# EAGLE design BT_interface (EAGLE 6.1)
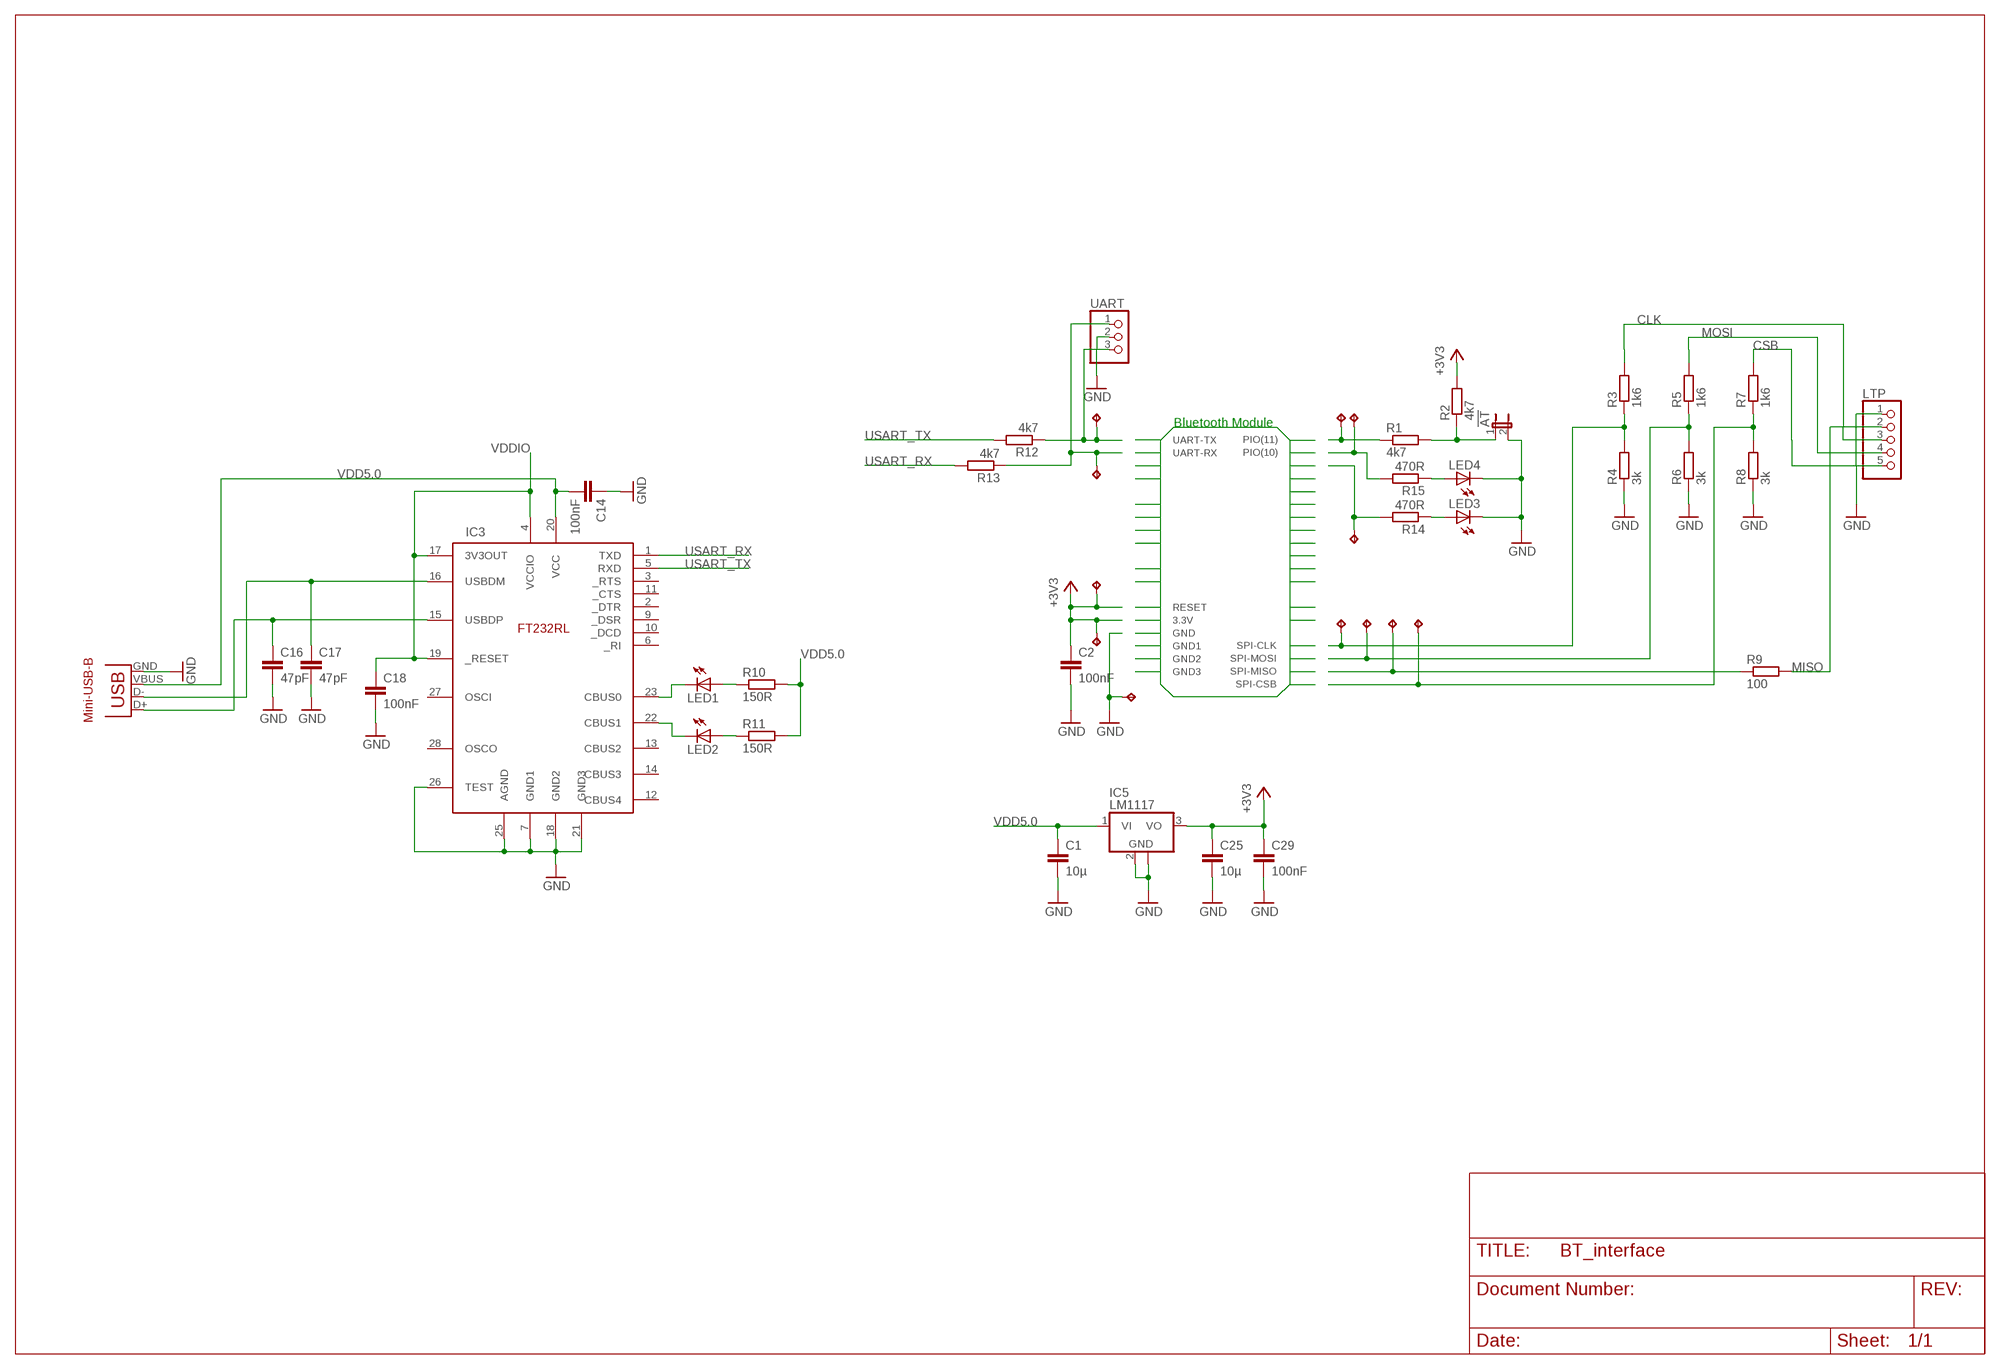
[diagram p0: schematic, sheet 1]

## Parts
!AT  JUMPER-2PTH  [1X02]
C1  10µ  C-EUC0805  [C0805]
C2  100nF  C-EUC0805  [C0805]
C14  100nF  C-EUC0805  [C0805]
C16  47pF  C-EUC0805  [C0805]
C17  47pF  C-EUC0805  [C0805]
C18  100nF  C-EUC0805  [C0805]
C25  10µ  C-EUC0805  [C0805]
C29  100nF  C-EUC0805  [C0805]
IC3  FT232RL  [SSOP28DB]
IC5  UA78M05DCY  [SOT223]
LED1  LEDCHIPLED_0603  [CHIPLED_0603]
LED2  LEDCHIPLED_0603  [CHIPLED_0603]
LED3  LEDCHIPLED_0603  [CHIPLED_0603]
LED4  LEDCHIPLED_0603  [CHIPLED_0603]
LTP  PINHD-1X5  [1X05]
R1  4k7  R-EU_R0805  [R0805]
R2  4k7  R-EU_R0805  [R0805]
R3  1k6  R-EU_R0805  [R0805]
R4  3k  R-EU_R0805  [R0805]
R5  1k6  R-EU_R0805  [R0805]
R6  3k  R-EU_R0805  [R0805]
R7  1k6  R-EU_R0805  [R0805]
R8  3k  R-EU_R0805  [R0805]
R9  100  R-EU_R0805  [R0805]
R10  150R  R-EU_R0805  [R0805]
R11  150R  R-EU_R0805  [R0805]
R12  4k7  R-EU_R0805  [R0805]
R13  4k7  R-EU_R0805  [R0805]
R14  470R  R-EU_R0805  [R0805]
R15  470R  R-EU_R0805  [R0805]
U$2  SPRING_HEADER  [SPRING_HEADER]
U$3  SPRING_HEADER  [SPRING_HEADER]
U$4  SPRING_HEADER  [SPRING_HEADER]
U$5  SPRING_HEADER  [SPRING_HEADER]
U$6  SPRING_HEADER  [SPRING_HEADER]
U$7  SPRING_HEADER  [SPRING_HEADER]
U$8  SPRING_HEADER  [SPRING_HEADER]
U$9  SPRING_HEADER  [SPRING_HEADER]
U$10  SPRING_HEADER  [SPRING_HEADER]
U$11  SPRING_HEADER  [SPRING_HEADER]
U$12  SPRING_HEADER  [SPRING_HEADER]
U$13  SPRING_HEADER  [SPRING_HEADER]
UART  PINHD-1X3  [1X03]
USB1  USB-MB-S2  [USB-MP-S2]

## Nets
+3V3: C2.1 C25.1 C29.1 IC5.3(VO) R2.2 U$4.P$1(TP) U$5.P$1(TP)
CLK: LTP.3 R3.2
CSB: LTP.5 R7.2
D+: C16.1 IC3.15(USBDP) USB1.D+
D-: C17.1 IC3.16(USBDM) USB1.D-
GND: !AT.2 C1.2 C2.2 C14.1 C16.2 C17.2 C18.2 C25.2 C29.2 IC3.7(GND1) IC3.18(GND2) IC3.21(GND3) IC3.25(AGND) IC3.26(TEST) IC5.2(GND) IC5.4(GND) LED3.C LED4.C LTP.1 R4.1 R6.1 R8.1 U$6.P$1(TP) UART.2 USB1.GND
MISO: LTP.2 R9.2
MOSI: LTP.4 R5.2
N$1: R1.1 U$9.P$1(TP)
N$2: IC3.23(CBUS0) LED1.C
N$3: IC3.22(CBUS1) LED2.C
N$4: LED1.A R10.1
N$5: LED2.A R11.1
N$6: !AT.1 R1.2 R2.1
N$7: R7.1 R8.2 U$11.P$1(TP)
N$8: R5.1 R6.2 U$7.P$1(TP)
N$9: R3.1 R4.2 U$8.P$1(TP)
N$10: R12.1 U$2.P$1(TP) UART.3
N$11: R13.1 U$3.P$1(TP) UART.1
N$12: LED3.A R14.1
N$13: LED4.A R15.1
N$14: R14.2 U$13.P$1(TP)
N$15: R9.1 U$10.P$1(TP)
N$16: R15.2 U$12.P$1(TP)
USART_RX: IC3.1(TXD) R13.2
USART_TX: IC3.5(RXD) R12.2
VDD5.0: C1.1 C14.2 IC3.20(VCC) IC5.1(VI) R10.2 R11.2 USB1.VBUS
VDDIO: C18.1 IC3.4(VCCIO) IC3.17(3V3OUT) IC3.19(_RESET)
Unconnected: IC3.2(_DTR) IC3.3(_RTS) IC3.6(_RI) IC3.9(_DSR) IC3.10(_DCD) IC3.11(_CTS) IC3.12(CBUS4) IC3.13(CBUS2) IC3.14(CBUS3) IC3.27(OSCI) IC3.28(OSCO)

## Notes on the sheet
- Bluetooth Module
- PIO(11)
- UART-TX
- PIO(10)
- UART-RX
- RESET
- 3.3V
- FT232RL
- GND
- SPI-CLK
- GND1
- SPI-MOSI
- GND2
- SPI-MISO
- GND3
- SPI-CSB
- Mini-USB-B

## Library data of the parts
!AT = daGloane:JUMPER-2: Jumper Basic 0.1" spaced jumper. Use with breakaway headers.
C1 C2 C14 C16-C18 C25 C29 = rcl:C-EU: CAPACITOR, European symbol
IC3 = ftdichip:FT232RL: USB UART 4th Generation USB UART (USB <-> Serial) Controller
IC5 = linear:UA78M*: POSITIVE-VOLTAGE REGULATORS Source: http://focus.ti.com/lit/ds/symlink/ua78m33.pdf; LM1117: LM1117
LED1-LED4 = led:LED: LED OSRAM: - CHIPLED LG R971, LG N971, LY N971, LG Q971, LY Q971, LO R971, LY R971 LH N974, LH R974 LS Q976, LO Q976, LY Q976 LO Q996 - Hyper CHIPLED LW Q18S LB Q993, LB Q99A, LB R99A - SideLED LS A670, LO A670, LY A670, LG A670, LP A670 LB A673, LV A673, LT A673, LW A673 LH A674 LY A675 LS A676, LA A676, LO A676, LY A676, LW A676 LS A679, LY A679, LG A679 - Hyper Micro SIDELED® LS Y876, LA Y876, LO Y876, LY Y876 LT Y87S - SmartLED LW L88C, LW L88S LB L89C, LB L89S, LG L890 LS L89K, LO L89K, LY L89K LS L896, LA L896, LO L896, LY L896 - TOPLED LS T670, LO T670, LY T670, LG T670, LP T670 LSG T670, LSP T670, LSY T670, LOP T670, LYG T670 LG T671, LOG T671, LSG T671 LB T673, LV T673, LT T673, LW T673 LH T674 LS T676, LA T676, LO T676, LY T676, LB T676, LH T676, LSB T676, LW T676 LB T67C, LV T67C, LT T67C, LS T67K, LO T67K, LY T67K, LW E67C LS E67B, LA E67B, LO E67B, LY E67B, LB E67C, LV E67C, LT E67C LW T67C LS T679, LY T679, LG T679 LS T770, LO T770, LY T770, LG T770, LP T770 LB T773, LV T773, LT T773, LW T773 LH T774 LS E675, LA E675, LY E675, LS T675 LS T776, LA T776, LO T776, LY T776, LB T776 LHGB T686 LT T68C, LB T68C - Hyper Mini TOPLED® LB M676 - Mini TOPLED Santana® LG M470 LS M47K, LO M47K, LY M47K Source: http://www.osram.convergy.de LUXEON: - LUMILED® LXK2-PW12-R00, LXK2-PW12-S00, LXK2-PW14-U00, LXK2-PW14-V00 LXK2-PM12-R00, LXK2-PM12-S00, LXK2-PM14-U00 LXK2-PE12-Q00, LXK2-PE12-R00, LXK2-PE12-S00, LXK2-PE14-T00, LXK2-PE14-U00 LXK2-PB12-K00, LXK2-PB12-L00, LXK2-PB12-M00, LXK2-PB14-N00, LXK2-PB14-P00, LXK2-PB14-Q00 LXK2-PR12-L00, LXK2-PR12-M00, LXK2-PR14-Q00, LXK2-PR14-R00 LXK2-PD12-Q00, LXK2-PD12-R00, LXK2-PD12-S00 LXK2-PH12-R00, LXK2-PH12-S00 LXK2-PL12-P00, LXK2-PL12-Q00, LXK2-PL12-R00 Source: www.luxeon.com KINGBRIGHT: KA-3528ASYC Source: www.kingbright.com
LTP = pinhead:PINHD-1X5: PIN HEADER
R1-R15 = rcl:R-EU_: RESISTOR, European symbol
U$2-U$13 = daGloane:SPRING_HEADER
UART = pinhead:PINHD-1X3: PIN HEADER
USB1 = con-usb:USB: USB Connectors

## Board
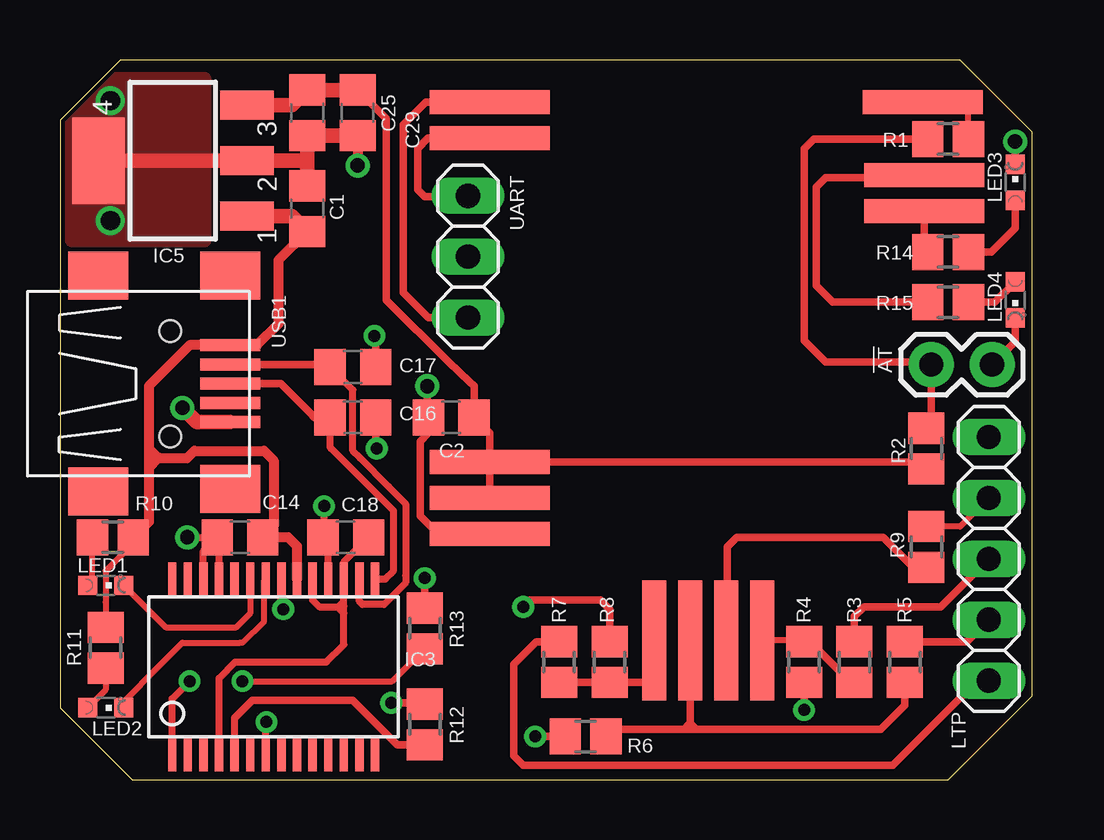
[diagram p1: board, top side]
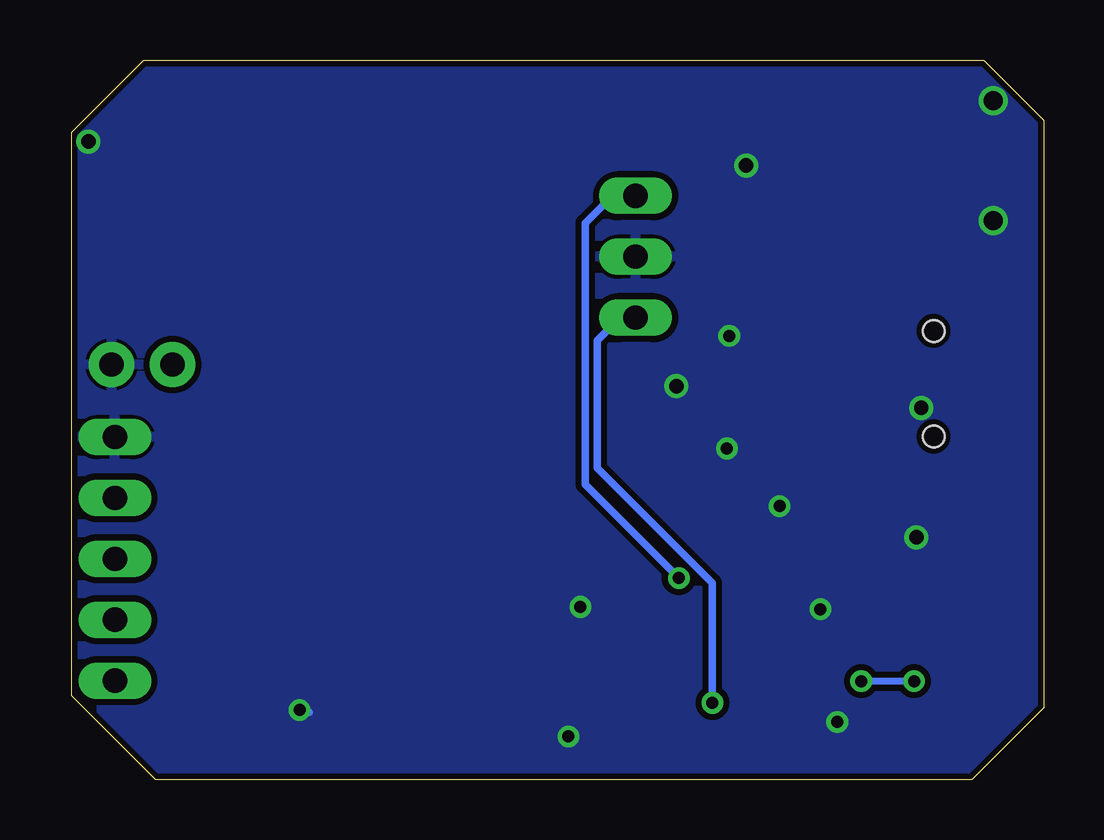
[diagram p2: board, bottom side, seen from below]

Size 40.5 x 30 mm. Coordinates in mm from the lower left corner, seen from the top.
Outline: 3,0 37,0 40.5,3.5 40.5,27 37.5,30 2.5,30 0,27.5 0,3 3,0
Copper layers (1*16): Top 0.035mm / dielectric 1.5mm / Bottom 0.035mm
Design rules: minimum track width 0.15mm, minimum drill 0.3mm, track to track 0.15mm, track to pad 0.15mm, pad to pad 0.15mm, via to via 0.15mm, smd to smd 0mil, copper to edge 0.2mm, drill to drill 0.2mm, minimum pad ring 0.2mm, minimum via ring 0.2mm, stop-mask expansion 4mil, vias tented up to drill 0.8mm, thermal gap 0.15mm

### Footprints (pad centres in the part's own frame; a part is rotated, then mirrored left to right if it is on the bottom)
1X02 = drill 1.016 pad 1.88: 1 0,0; 2 2.54,0
C0805 = smd 1.3 x 1.5: 1 -0.95,0; 2 0.95,0
SSOP28DB = smd 0.348 x 1.397: 1 -4.225,-3.656; 2 -3.575,-3.656; 3 -2.925,-3.656; 4 -2.275,-3.656; 5 -1.625,-3.656; 6 -0.975,-3.656; 7 -0.325,-3.656; 8 0.325,-3.656; 9 0.975,-3.656; 10 1.625,-3.656; 11 2.275,-3.656; 12 2.925,-3.656; 13 3.575,-3.656; 14 4.225,-3.656; 15 4.225,3.656; 16 3.575,3.656; 17 2.925,3.656; 18 2.275,3.656; 19 1.625,3.656; 20 0.975,3.656; 21 0.325,3.656; 22 -0.325,3.656; 23 -0.975,3.656; 24 -1.625,3.656; 25 -2.275,3.656; 26 -2.925,3.656; 27 -3.575,3.656; 28 -4.225,3.656
SOT223 = smd 1.219 x 2.235: 1 -2.311,-3.099; 2 0,-3.099; 3 2.311,-3.099 | smd 3.6 x 2.2: 4 0,3.099
CHIPLED_0603 = smd 0.8 x 0.8: A 0,-0.75; C 0,0.75
1X05 = drill 1.016 long: 1 -5.08,0; 2 -2.54,0; 3 0,0; 4 2.54,0; 5 5.08,0
R0805 = smd 1.3 x 1.5: 1 -0.85,0; 2 0.85,0
SPRING_HEADER = smd 5 x 1: P$1 0,0
1X03 = drill 1.016 long: 1 -2.54,0; 2 0,0; 3 2.54,0
USB-MP-S2 = smd 2.5 x 0.5: D+ 2.487,0.005; D- 2.487,0.805; GND 2.487,-1.595; ID 2.487,-0.795; VBUS 2.487,1.605 | smd 2.5 x 2: P$1 -3.013,-4.495; P$2 -3.013,4.505; P$3 2.487,-4.395; P$4 2.487,4.505 | hole 0.9: -0.013,2.205; -0.013,-2.195

### Placement (x,y rotation side)
!AT  36.3,17.3 0 top
C1  10.3,23.8 90 top
C2  16.3,15.1 180 top
C14  7.5,10.1 0 top
C16  12.2,15.1 0 top
C17  12.2,17.2 0 top
C18  11.91,10.1 180 top
C25  10.3,27.8 270 top
C29  12.4,27.8 270 top
IC3  8.9,4.7 0 top
IC5  4.7,25.8 90 top
LED1  1.9,8.1 270 top
LED2  1.9,3 270 top
LED3  39.8,24.9 0 top
LED4  39.8,20 180 top
LTP  38.7,9.2 270 top
R1  37,26.7 180 top
R2  36.1,13.8 270 top
R3  33.1,4.9 90 top
R4  31,4.9 90 top
R5  35.2,4.9 90 top
R6  21.9,1.8 0 top
R7  20.8,4.9 90 top
R8  22.9,4.9 270 top
R9  36.1,9.7 90 top
R10  2.2,10.1 0 top
R11  1.9,5.5 90 top
R12  15.2,2.3 270 top
R13  15.2,6.3 270 top
R14  37,22 180 top
R15  37,19.9 180 top
U$2  17.9,28.23 0 top
U$3  17.9,26.73 0 top
U$4  17.9,13.23 0 top
U$5  17.9,11.73 0 top
U$6  17.9,10.23 0 top
U$7  26.25,5.8 90 top
U$8  29.25,5.8 90 top
U$9  35.95,28.23 0 top
U$10  27.75,5.8 90 top
U$11  24.75,5.8 90 top
U$12  36,25.2 0 top
U$13  36,23.7 0 top
UART  17,21.8 270 top
USB1  4.6,16.5 0 top

### Tracks (layer width: path | path; a pad name or v marks a point on that pad's centre or on a via)
+3V3
  Top 0.254: 24.13,13.23 24.6,13.23 | 33.4,13.23 34.17,13.23 | U$4.P$1 18.75,13.23
  Top 0.305: C29.1 13.6,27.55 13.6,20 16.2,17.4 17.05,16.6 17.25,16.4 C2.1 17.9,14.45 U$4.P$1 U$5.P$1 18.75,11.73 | R2.2 35.82,13.23 35.02,13.23 33.4,13.23 24.6,13.23 18.75,13.23
  Top 0.61: IC5.3 9.66,28.11 C25.1 C29.1
CLK
  Top 0.305: R3.2 33.1,6.8 33.5,7.2 36.1,7.2 36.7,7.2 LTP.3
CSB
  Top 0.305: LTP.5 38.2,4.09 35.51,1.4 34.7,0.6 19.3,0.6 18.9,1 18.9,1.9 18.9,4.8 19.7,5.6 19.85,5.75 R7.2
D+
  Top 0.3: C16.1 11.25,13.85 11.3,13.8 13.12,11.97 13.9,11.2 13.9,8.7 13.56,8.36 IC3.15
  Top 0.305: USB1.D+ 9.2,16.5 10.4,15.3 10.6,15.1 C16.1 | 11.53,15.1 C16.1 | 11.5,14.9 11.45,14.9 C16.1
  Top 0.406: 11.5,14.9 11.53,14.88
D-
  Top 0.3: C17.1 12.2,16.25 12.2,13.7 12.5,13.4 13.7,12.2 14.4,11.5 14.4,8.5 14.4,8.2 13.5,7.3 12.6,7.3 12.5,7.4 12.47,7.42 IC3.16
  Top 0.305: USB1.D- 11.15,17.3 C17.1
GND  (via drill 0.5, 0.6, 0.8)
  Top 0.254: 15.7,10.3 17.83,10.3 U$6.P$1
  Top 0.3: IC3.25 6.62,10.03 C14.1 | IC3.26 5.97,9.53 C14.1 | v5.3,10.1 C14.1 | IC3.7 8.57,2.38 v8.6,2.4 | IC3.18 11.18,9.88 C18.2 11,10.14 v11,11.4 | v9.3,7.1 9.22,7.17 IC3.21
  Top 0.305: C17.2 13.15,18.45 v13.1,18.5 | C16.2 13.15,13.85 v13.2,13.8 | C2.2 15.8,14.9 | R4.1 v31,2.9 | R8.1 22.9,7.1 22.5,7.5 19.6,7.5 v19.3,7.2 | 15.7,10.3 15,11 15,14.1 15.35,14.45 C2.2 | C2.2 15.3,15.15 v15.3,16.4 | v19.8,1.8 R6.1 | R6.1 21.1,1.8 R6.1 | LED4.C 39.8,18.26 !AT.2 | LED3.C v39.8,26.6
  Top 0.406: C29.2 v12.4,25.6
  Top 0.61: 10.3,25.8 IC5.2 IC5.4 | 10.3,25.8 C25.2 C29.2 | C1.2 10.3,25.8 | v5.1,15.5 5.7,14.9 USB1.GND
  Bottom 0.305: v13.1,18.5 12.8,18.4 | 30.9,2.8 30.6,2.8
  other vias: 2.1,28.3 2.1,23.3
  pour Top (no thermals): 0.5,29.2 6,29.2 6,22.5 0.5,22.5
  pour Bottom (isolate 0.254): 2.5,30 37.5,30 40.5,27 40.5,3.5 37,0 3,0 0,3 0,27.5
MISO
  Top 0.254: LTP.2 37.51,10.55 R9.2
MOSI
  Top 0.305: LTP.4 37.89,5.85 37.79,5.75 R5.2
N$1
  Top 0.254: R1.1 37.85,28.23 U$9.P$1
N$2
  Top 0.254: IC3.23 7.92,6.92 7.4,6.4 7.35,6.35 4.4,6.35 LED1.C
N$3
  Top 0.254: IC3.22 8.5,8.28 8.5,6.6 7.6,5.7 7.5,5.7 5.1,5.7 4.1,4.7 2.65,3.25 LED2.C
N$4
  Top 0.254: LED1.A 1.35,8.1 R10.1
N$5
  Top 0.254: R11.1 1.9,3.75 LED2.A
N$6
  Top 0.254: R2.1 35.7,14.65
  Top 0.305: R1.2 31.4,26.7 31,26.3 31,18.3 31.9,17.4 35.6,17.4 36.2,17.4 !AT.1 36.3,15.25 35.7,14.65
N$7
  Top 0.254: U$11.P$1 24.55,4.75
  Top 0.305: R7.1 R8.2 24.55,4.05 24.55,4.75
N$8
  Top 0.305: 26.25,2.42 26.25,2.4 26.25,2.35 | 26.25,2.35 26.25,2.2 26.3,2.15 26.3,2.1 | 26.5,2.1 33.4,2.1 34.2,2.1 35.2,3.1 R5.1 | R5.1 35.2,4.1 R5.1 | R6.2 22.55,2.1 25.9,2.1 26,2.1 | 26.25,2.42 26.25,2.35 | 26.5,2.1 26.3,2.1 | 26.3,2.1 26,2.1 | 26.25,2.42 U$7.P$1 | 26.5,2.1 26.3,2.3 26.2,2.3 26,2.1
N$9
  Top 0.254: R4.2 30.95,5.8 U$8.P$1
  Top 0.305: R4.2 30.95,5.8 | R4.2 31.25,5.85 | R3.1 32.95,4.15 32.85,4.15 32,5 31.25,5.75 R4.2
N$10  (via drill 0.5)
  Top 0.305: U$2.P$1 15.23,28.23 14.3,27.3 14.3,20.3 15.2,19.4 15.34,19.26 UART.3 | 15.65,3.15 R12.1 15.15,3.2 v13.8,3.2
  Bottom 0.305: 15.66,19.26 UART.3 17.64,19.26 18.6,18.3 18.6,13.9 18.6,13 13.8,8.2 v13.8,3.2
N$11  (via drill 0.5)
  Top 0.305: U$3.P$1 15.33,26.73 14.9,26.3 14.9,24.6 15.2,24.3 16.96,24.3 UART.1 | R13.1 v15.2,8.4
  Bottom 0.305: UART.1 17.96,24.34 19.1,23.2 19.1,12.8 19.1,12.3 v15.2,8.4
N$12
  Top 0.254: R14.1 38.45,22
  Top 0.305: 38.45,22 38.8,22 39.8,23 LED3.A
N$13
  Top 0.305: R15.1 38.95,19.9 LED4.A
N$14
  Top 0.254: R14.2 36,22.15
  Top 0.305: 35.3,23.7 U$13.P$1 36,22.15
N$15
  Top 0.305: 27.8,9.2 27.8,9.7 28.2,10.1 33.2,10.1 34.3,10.1 35.55,8.85 R9.1 | 27.8,9.2 27.8,8.88 27.8,8.2 | U$10.P$1 27.8,5.85 27.8,9.2
N$16
  Top 0.305: U$12.P$1 35.9,25.1 31.9,25.1 31.5,24.7 31.5,20.6 32.2,19.9 R15.2
USART_RX  (via drill 0.5)
  Top 0.254: v7.6,4.1 13.85,4.1 R13.2
  Top 0.3: IC3.1 4.67,3.38 v5.4,4.1
  Bottom 0.3: v5.4,4.1 v7.6,4.1
USART_TX
  Top 0.3: IC3.5 7.28,2.58
  Top 0.305: 7.28,2.58 8,3.3 9.3,3.3 12.2,3.3 13.9,1.6 14.05,1.45 14.75,1.45 R12.2
VDD5.0
  Top 0.254: R10.2 3.05,9.85 1.9,8.7 1.9,7.4 R11.2
  Top 0.3: 8.8,10.1 8.7,10.1 C14.2
  Top 0.406: C1.1 9.1,21.65 9.1,19 8.21,18.11 USB1.VBUS 5.41,18.11 3.7,16.4 3.7,14 | 3.7,14 3.7,13.9 | C14.2 8.9,10.55 8.9,13.3 8.5,13.7 5.6,13.7 5.3,13.4 4.2,13.4 4.1,13.4 | 3.7,14 3.7,13.8 | 3.7,13.8 3.7,13 | 3.7,13 3.7,12.1 3.7,10.75 R10.2 | 4.1,13.4 3.7,13 | 4.1,13.4 3.7,13.8 | IC3.20 9.88,9.72 9.5,10.1 8.7,10.1
  Top 0.61: C1.1 9.66,23.49 IC5.1
VDDIO
  Top 0.3: C18.1 11.82,9.06 IC3.17 11.82,7.7 | IC3.19 10.53,7.47 10.8,7.2 11.6,7.2 | 11.6,7.2 11.8,7.2 11.82,7.22 11.82,7.7 | IC3.4 6.62,4.22 7.3,4.9 11.1,4.9 11.8,5.6 11.82,5.62 11.82,6.94 | 11.82,6.94 11.82,7.7 | 11.82,6.94 11.6,7.16 11.6,7.2 | 11.6,7.2 11.8,7.4